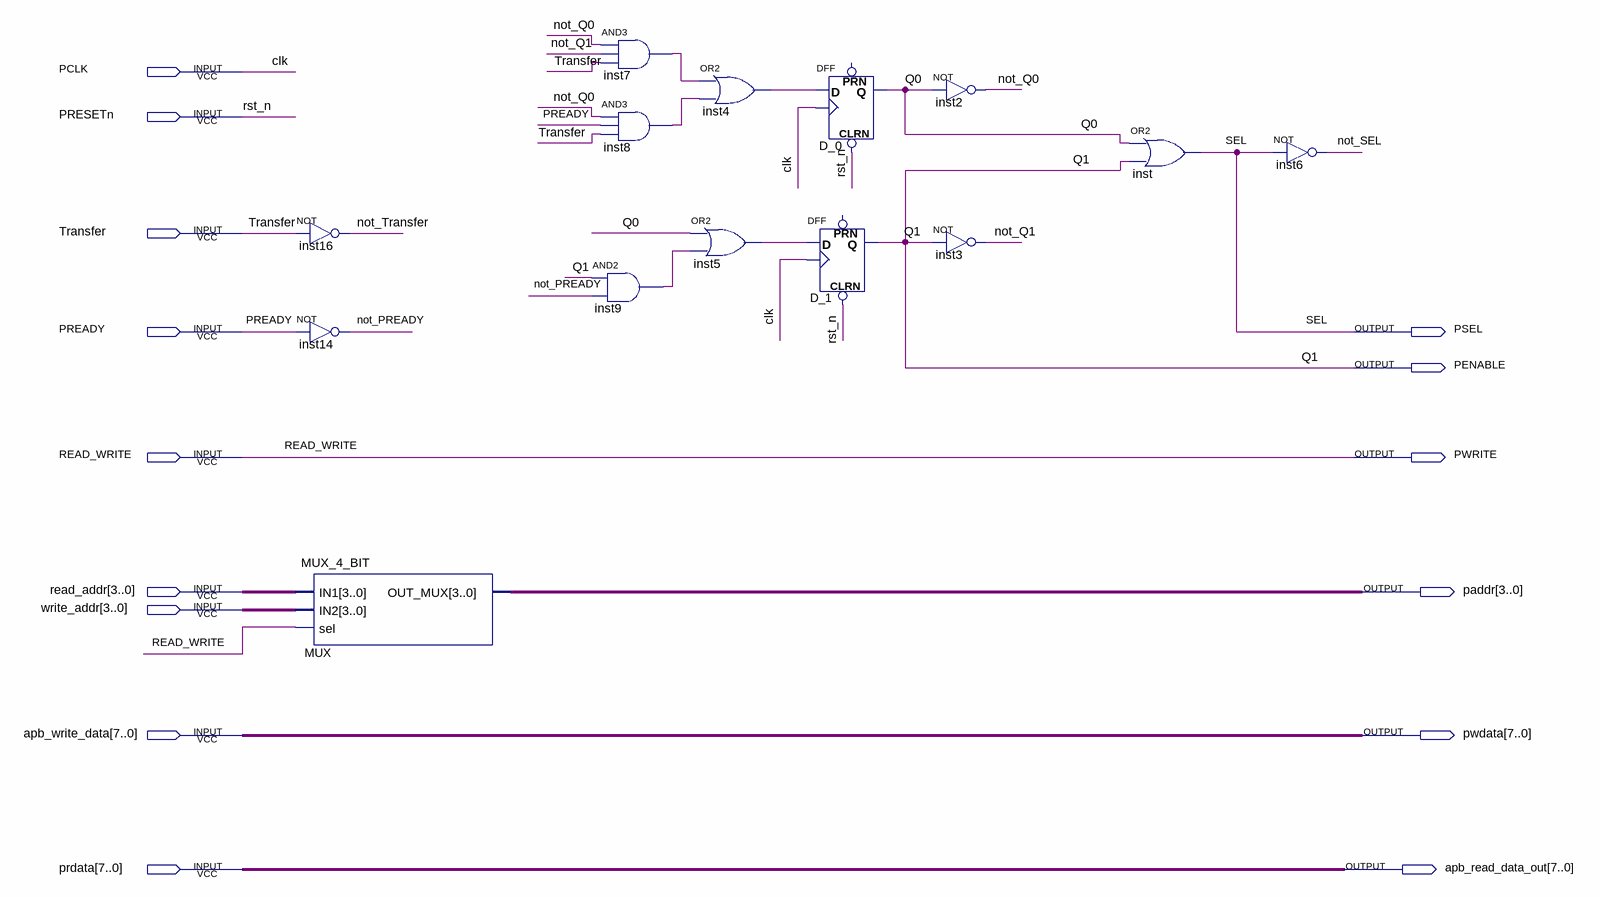
[diagram p0: schematic sheet]
// Quartus schematic MASTER.bdf as structural Verilog: 14 symbols, 15 pins
module MASTER (
  input  PCLK,
  input  PRESETn,
  input  Transfer,
  input  PREADY,
  input  READ_WRITE,
  input  [3:0] read_addr,
  input  [3:0] write_addr,
  input  [7:0] apb_write_data,
  input  [7:0] prdata,
  output PSEL,
  output PENABLE,
  output PWRITE,
  output [3:0] paddr,
  output [7:0] pwdata,
  output [7:0] apb_read_data_out
);

  wire inst4_out, inst5_out, inst7_out, inst8_out, inst9_out, not_PREADY, not_Q0, not_Q1, not_SEL,
       not_Transfer, Q0;

  not inst16 (not_Transfer, Transfer);
  not inst14 (not_PREADY, PREADY);
  MUX_4_BIT MUX (.IN1(read_addr), .IN2(write_addr), .sel(READ_WRITE), .OUT_MUX(paddr));
  and inst7 (inst7_out, not_Q0, not_Q1, Transfer);
  and inst8 (inst8_out, not_Q0, PREADY, Transfer);
  and inst9 (inst9_out, PENABLE, not_PREADY);
  or inst4 (inst4_out, inst7_out, inst8_out);
  or inst5 (inst5_out, Q0, inst9_out);
  DFF D_0 (.CLRN(PRESETn), .CLK(PCLK), .D(inst4_out), .Q(Q0));  // open: PRN
  DFF D_1 (.CLRN(PRESETn), .CLK(PCLK), .D(inst5_out), .Q(PENABLE));  // open: PRN
  not inst2 (not_Q0, Q0);
  not inst3 (not_Q1, PENABLE);
  or inst (PSEL, Q0, PENABLE);
  not inst6 (not_SEL, PSEL);

  assign apb_read_data_out = prdata;
  assign pwdata = apb_write_data;
  assign PWRITE = READ_WRITE;

  // Other names for the same wires on the sheet: clk = PCLK; Q1 = PENABLE; rst_n = PRESETn; SEL = PSEL
endmodule
